# EAGLE design myNucSatellite (EAGLE 7.6.0)
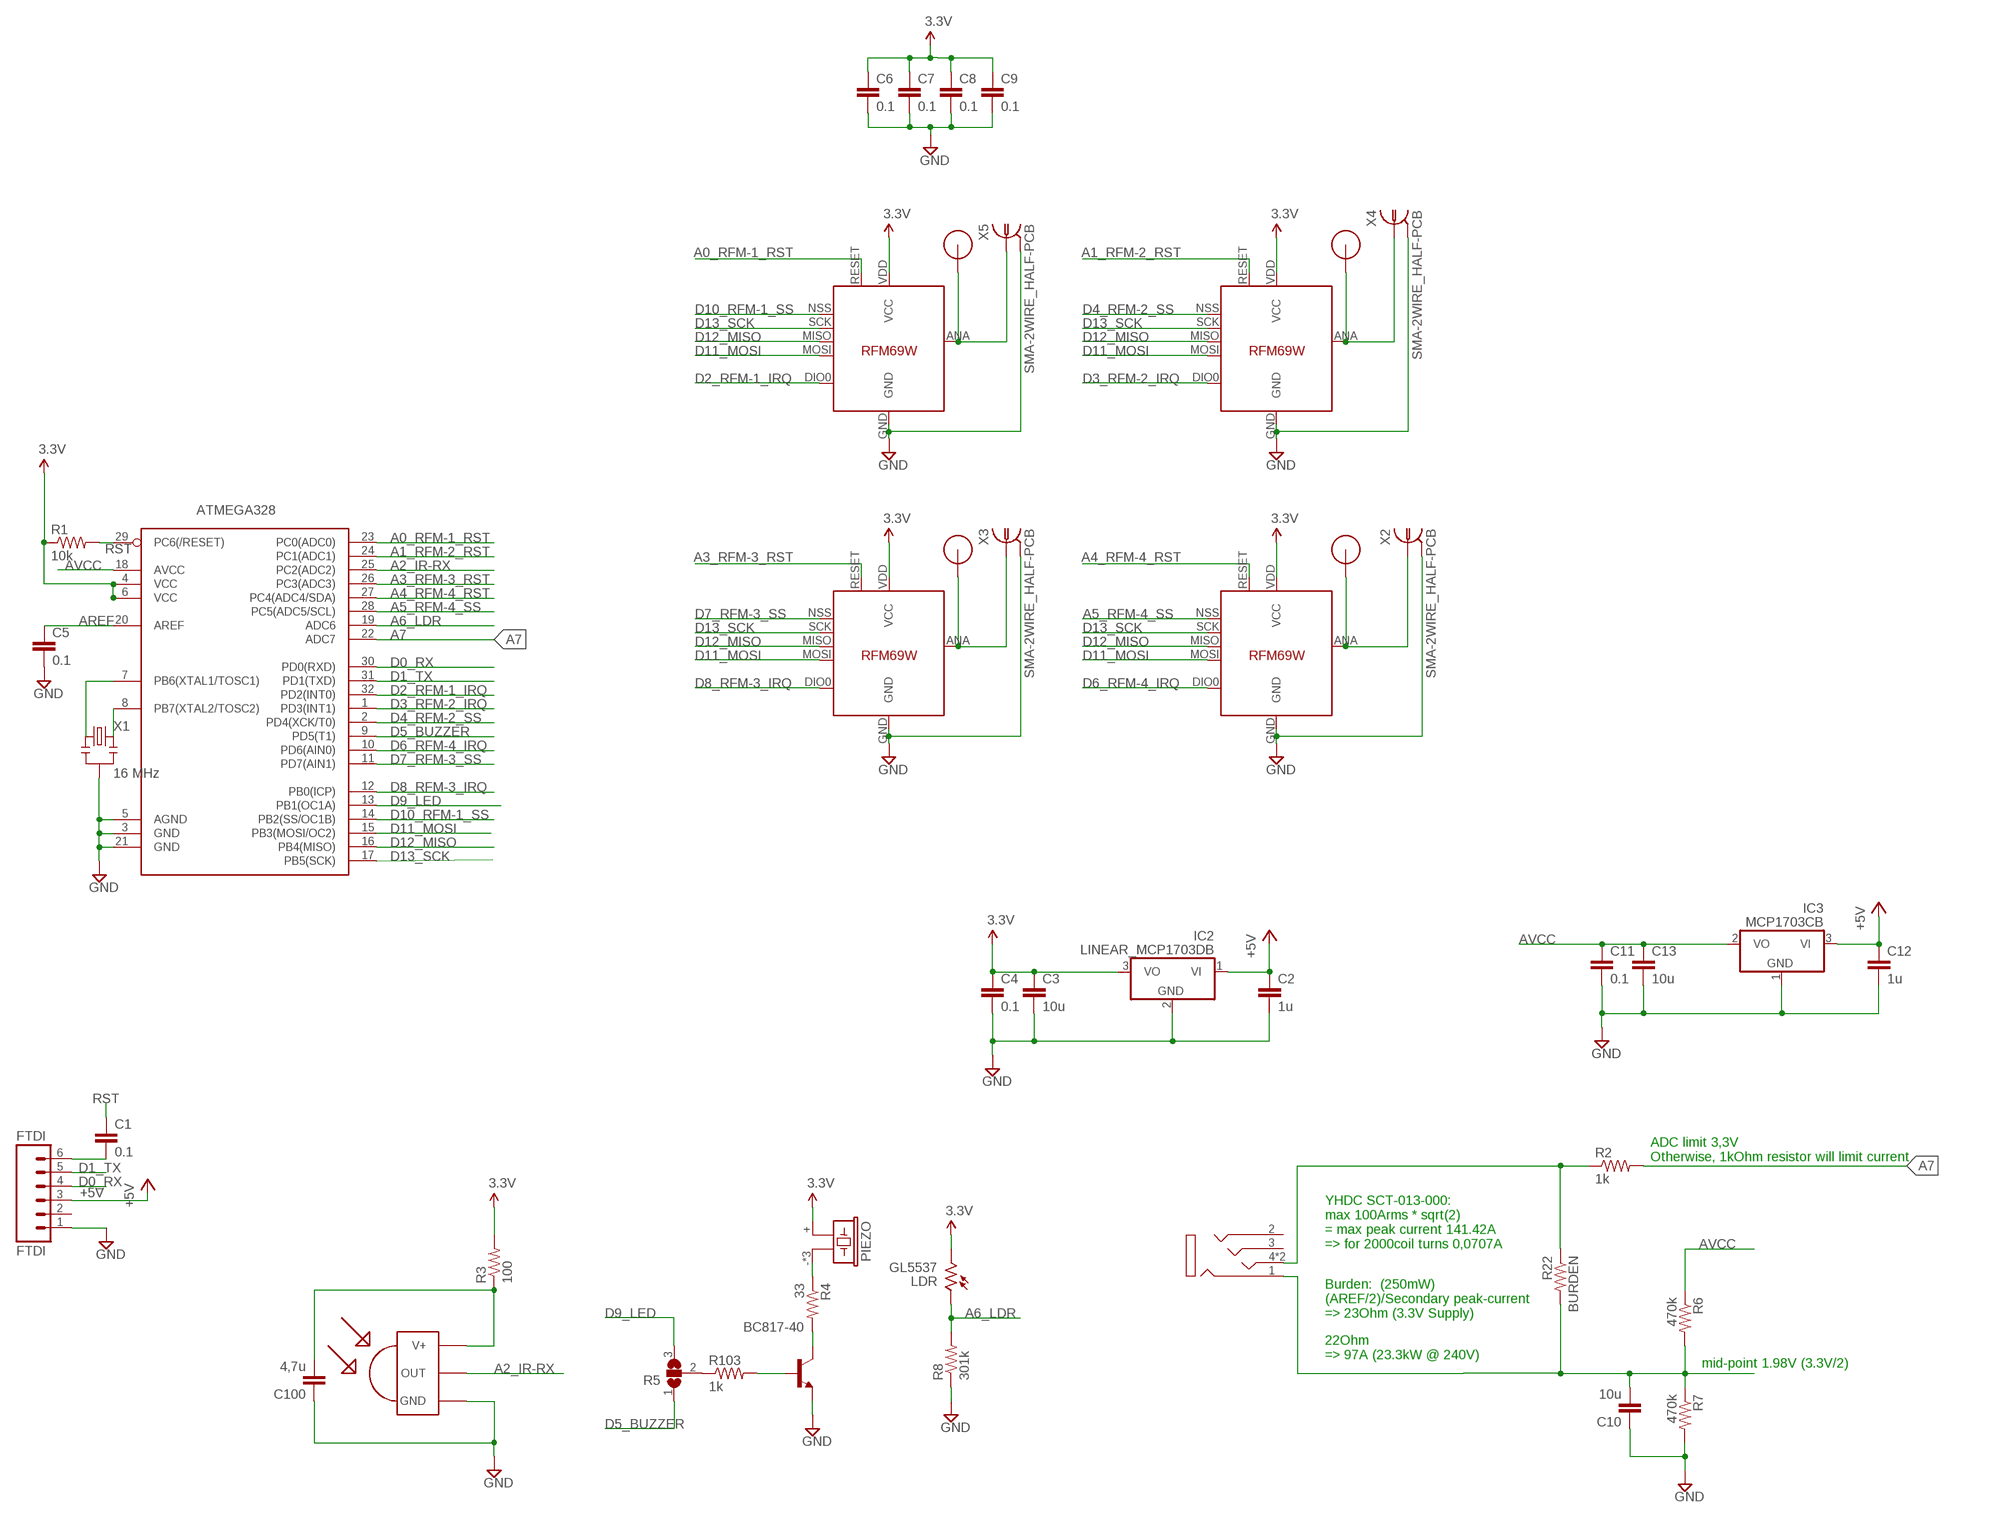
[diagram p0: schematic, sheet 1]

## Parts
ATMEGA328  ATMega-328  ATMEGA168/328TQFP32  [TQFP32-08]
BC817-40  BC817-40-NPN-SOT23-BEC  [SOT23-BEC]
BURDEN  R22  R-US_R0805  [R0805]
C1  0.1  CAP0603-CAP  [0603-CAP]
C2  1u  CAP0603-CAP  [0603-CAP]
C3  10u  CAP0805-CAP  [0805-CAP]
C4  0.1  CAP0603-CAP  [0603-CAP]
C5  0.1  CAP0603-CAP  [0603-CAP]
C6  0.1  CAP0603-CAP  [0603-CAP]
C7  0.1  CAP0603-CAP  [0603-CAP]
C8  0.1  CAP0603-CAP  [0603-CAP]
C9  0.1  CAP0603-CAP  [0603-CAP]
C10  10u  CAP0603-CAP  [0603-CAP]
C11  0.1  CAP0603-CAP  [0603-CAP]
C12  1u  CAP0603-CAP  [0603-CAP]
C13  10u  CAP0805-CAP  [0805-CAP]
C100  4,7u  CAP0603-CAP  [0603-CAP]
CT1  1503_13  [1503-03]
FTDI  FTDI  M06SIP  [1X06]
IC2  LINEAR_MCP1703DB  [LINEAR_SOT223]
IC3  MCP1703CB  [SOT23]
IR-RX  TSOP4836  [TSOP18XX]
LDR  GL5537  M9960_11A  [M9960]
PIEZO  BUZZER-PIEZO_SMD  [BUZZER-PIEZO_SMD]
R1  10k  RESISTOR0603-RES  [0603-RES]
R2  1k  RESISTOR0603-RES  [0603-RES]
R3  100  RESISTOR0603-RES  [0603-RES]
R4  33  RESISTOR0603-RES  [0603-RES]
R5  SELECT0603-SELECT  [0603-SELECT]
R6  470k  RESISTOR0603-RES  [0603-RES]
R7  470k  RESISTOR0603-RES  [0603-RES]
R8  301k  RESISTOR0603-RES  [0603-RES]
R103  1k  RESISTOR0603-RES  [0603-RES]
U$3  RFM12B_ANTENNA  [RFM12B-ANTENNA]
U$4  RFM69_MINIPADS  [RFM69W-MINPADS]
U$6  RFM12B_ANTENNA  [RFM12B-ANTENNA]
U$7  RFM69_MINIPADS  [RFM69W-MINPADS]
U$8  RFM12B_ANTENNA  [RFM12B-ANTENNA]
U$9  RFM69_MINIPADS  [RFM69W-MINPADS]
U$10  RFM12B_ANTENNA  [RFM12B-ANTENNA]
U$11  RFM69_MINIPADS  [RFM69W-MINPADS]
X1  16 MHz  RESONATORSMD  [RESONATOR-SMD]
X2  SMA-2WIRE_HALF-PCB  [SMA-EDGE-HALF]
X3  SMA-2WIRE_HALF-PCB  [SMA-EDGE-HALF]
X4  SMA-2WIRE_HALF-PCB  [SMA-EDGE-HALF]
X5  SMA-2WIRE_HALF-PCB  [SMA-EDGE-HALF]

## Nets
+5V [power]: C2.1 C12.1 FTDI.3 IC2.1(VI) IC3.3(VI)
A0_RFM-1_RST: ATMEGA328.23(PC0(ADC0)) U$4.RESET
A1_RFM-2_RST: ATMEGA328.24(PC1(ADC1)) U$7.RESET
A2_IR-RX: ATMEGA328.25(PC2(ADC2)) IR-RX.OUT
A3_RFM-3_RST: ATMEGA328.26(PC3(ADC3)) U$9.RESET
A4_RFM-4_RST: ATMEGA328.27(PC4(ADC4/SDA)) U$11.RESET
A5_RFM-4_SS: ATMEGA328.28(PC5(ADC5/SCL)) U$11.NSS(SEL)
A6_LDR: ATMEGA328.19(ADC6) LDR.1 R8.2
A7: ATMEGA328.22(ADC7) R2.2
AREF: ATMEGA328.20(AREF) C5.1
AVCC [power]: ATMEGA328.18(AVCC) C11.1 C13.1 IC3.2(VO) R6.1
D0_RX: ATMEGA328.30(PD0(RXD)) FTDI.4
D1_TX: ATMEGA328.31(PD1(TXD)) FTDI.5
D2_RFM-1_IRQ: ATMEGA328.32(PD2(INT0)) U$4.DIO0(DIO0/IRQ)
D3_RFM-2_IRQ: ATMEGA328.1(PD3(INT1)) U$7.DIO0(DIO0/IRQ)
D4_RFM-2_SS: ATMEGA328.2(PD4(XCK/T0)) U$7.NSS(SEL)
D5_BUZZER: ATMEGA328.9(PD5(T1)) R5.1
D6_RFM-4_IRQ: ATMEGA328.10(PD6(AIN0)) U$11.DIO0(DIO0/IRQ)
D7_RFM-3_SS: ATMEGA328.11(PD7(AIN1)) U$9.NSS(SEL)
D8_RFM-3_IRQ: ATMEGA328.12(PB0(ICP)) U$9.DIO0(DIO0/IRQ)
D9_LED: ATMEGA328.13(PB1(OC1A)) R5.3
D10_RFM-1_SS: ATMEGA328.14(PB2(SS/OC1B)) U$4.NSS(SEL)
D11_MOSI: ATMEGA328.15(PB3(MOSI/OC2)) U$4.MOSI U$7.MOSI U$9.MOSI U$11.MOSI
D12_MISO: ATMEGA328.16(PB4(MISO)) U$4.MISO U$7.MISO U$9.MISO U$11.MISO
D13_SCK: ATMEGA328.17(PB5(SCK)) U$4.SCK U$7.SCK U$9.SCK U$11.SCK
GND: ATMEGA328.3(GND) ATMEGA328.5(AGND) ATMEGA328.21(GND) BC817-40.E C2.2 C3.2 C4.2 C5.2 C6.2 C7.2 C8.2 C9.2 C10.1 C11.2 C12.2 C13.2 C100.1 FTDI.1 IC2.2(GND) IC3.1(GND) IR-RX.GND R7.2 R8.1 U$4.GND U$7.GND U$9.GND U$11.GND X1.2 X2.GND@0(GND) X2.GND@1(GND) X3.GND@0(GND) X3.GND@1(GND) X4.GND@0(GND) X4.GND@1(GND) X5.GND@0(GND) X5.GND@1(GND)
N$1: ATMEGA328.7(PB6(XTAL1/TOSC1)) X1.1
N$2: BURDEN.2 C10.2 CT1.1 R6.2 R7.1
N$3: PIEZO.- PIEZO.DUMMY PIEZO.DUMMY1 R4.1
N$4: R5.2 R103.1
N$5 [ANT]: U$3.P$1 U$4.ANA(ANT) X5.SIG(SIGNAL)
N$6: BURDEN.1 CT1.4 CT1.4-2 R2.1
N$7 [ANT]: U$6.P$1 U$7.ANA(ANT) X4.SIG(SIGNAL)
N$8: BC817-40.C R4.2
N$9 [ANT]: U$8.P$1 U$9.ANA(ANT) X3.SIG(SIGNAL)
N$11 [ANT]: U$10.P$1 U$11.ANA(ANT) X2.SIG(SIGNAL)
N$15: BC817-40.B R103.2
N$16: C100.2 IR-RX.VCC(V+) R3.1
N$20: C1.2 FTDI.6
N$21: ATMEGA328.8(PB7(XTAL2/TOSC2)) X1.3
RST: ATMEGA328.29(PC6(/RESET)) C1.1 R1.2
VCC [power]: ATMEGA328.4(VCC) ATMEGA328.6(VCC) C3.1 C4.1 C6.1 C7.1 C8.1 C9.1 IC2.3(VO) LDR.2 PIEZO.+ R1.1 R3.2 U$4.VDD(VCC) U$7.VDD(VCC) U$9.VDD(VCC) U$11.VDD(VCC) ; supply symbol labelled 3.3V
Unconnected: CT1.2 CT1.3 FTDI.2

## Notes on the sheet
- ADC limit 3,3V
  Otherwise, 1kOhm resistor will limit current
- YHDC SCT-013-000: 
  max 100Arms * sqrt(2)
  = max peak current 141.42A
  => for 2000coil turns 0,0707A
- Burden:  (250mW)
  (AREF/2)/Secondary peak-current
  => 23Ohm (3.3V Supply)
- 22Ohm 
  => 97A (23.3kW @ 240V)
- mid-point 1.98V (3.3V/2)

## Library data of the parts
ATMEGA328 = LowPowerLab:ATMEGA168/328: Atmel 32-pin 8-bit micro, 16k flash.; BUERKLIN: 64 S 4010; CONRAD: 155196 - 62
BC817-40 = myLib:*-NPN-: NPN Transistror BF959 corrected 2008.03.06; BUERKLIN: 12S6220
BURDEN = resistor:R-US_: RESISTOR, American symbol; BUERKLIN: 12 E 120
C1 C4-C9 C11 = LowPowerLab:CAP: Capacitor Standard 0603 ceramic capacitor, and 0.1" leaded capacitor.; BUERKLIN: 53 D 1726
C2 C12 = LowPowerLab:CAP: Capacitor Standard 0603 ceramic capacitor, and 0.1" leaded capacitor.; BUERKLIN: 53D1660
C3 C13 = myLib:CAP: Capacitor Standard 0603 ceramic capacitor, and 0.1" leaded capacitor.; BUERKLIN: 53 D 2432
C10 = LowPowerLab:CAP: Capacitor Standard 0603 ceramic capacitor, and 0.1" leaded capacitor.; BUERKLIN: 53 D 2088
C100 = LowPowerLab:CAP: Capacitor Standard 0603 ceramic capacitor, and 0.1" leaded capacitor.; BUERKLIN: 53 D 1659
CT1 = myLib:1503_13; BUERKLIN: 39F1215
FTDI = SparkFun-Connectors:M06: Header 6 Standard 6-pin 0.1" header. Use with straight break away headers (SKU : PRT-00116), right angle break away headers (PRT-00553), swiss pins (PRT-00743), machine pins (PRT-00117), and female headers (PRT-00115). Molex polarized connector foot print use with SKU : PRT-08094 with associated crimp pins and housings. NOTES ON THE VARIANTS LOCK and LOCK_LONGPADS... This footprint was designed to help hold the alignment of a through-hole component (i.e. 6-pin header) while soldering it into place. You may notice that each hole has been shifted either up or down by 0.005 of an inch from it's more standard position (which is a perfectly straight line). This slight alteration caused the pins (the squares in the middle) to touch the edges of the holes. Because they are alternating, it causes a "brace" to hold the component in place. 0.005 has proven to be the perfect amount of "off-center" position when using our standard breakaway headers. Although looks a little odd when you look at the bare footprint, once you have a header in there, the alteration is very hard to notice. Also, if you push a header all the way into place, it is covered up entirely on the bottom side. This idea of altering the position of holes to aid alignment will be further integrated into the Sparkfun Library for other footprints. It can help hold any component with 3 or more connection pins.; BUERKLIN: 59 F 2134
IC2 = myLib:LINEAR_MCP1703: 250 mA, 16V, Low Quiescent Current LDO Regulator Source: http://ww1.microchip.com/downloads/en/DeviceDoc/22049b.pdf; BUERKLIN: 41 S 7654
IC3 = linear:MCP1703: 250 mA, 16V, Low Quiescent Current LDO Regulator Source: http://ww1.microchip.com/downloads/en/DeviceDoc/22049b.pdf; CONRAD: 651422-62
IR-RX = myLib:TSOP4836: IR Receiver and Demodulator; CONRAD: 171107-62; EBAY: TSOP34836
LDR = photo-elements:M9960_11: Photo Sensor Beacon Light, Photometer Applications Source: http://optoelectronics.perkinelmer.com/content/Datasheets/DTS_M9960.pdf; EBAY: GL5537
PIEZO = myLib:BUZZER-PIEZO_SMD: Piezoelectric Acoustic Transducer; BERKLIN_2: 36 M 346; BUERKLIN: 36 M 370; BUERKLIN_1: 36 M 368
R1 = LowPowerLab:RESISTOR: Resistor Basic schematic elements and footprints for 0603, 1206, and PTH resistors.; BUERKLIN: 26 E 816
R2 R103 = LowPowerLab:RESISTOR: Resistor Basic schematic elements and footprints for 0603, 1206, and PTH resistors.; BUERKLIN: 26 E 792
R3 = LowPowerLab:RESISTOR: Resistor Basic schematic elements and footprints for 0603, 1206, and PTH resistors.; BUERKLIN: 26 E 768
R4 = LowPowerLab:RESISTOR: Resistor Basic schematic elements and footprints for 0603, 1206, and PTH resistors.; BUERKLIN: 26 E 756
R5 = myLib:SELECT: Resistor Basic schematic elements and footprints for 0603, 1206, and PTH resistors.
R6 R7 = LowPowerLab:RESISTOR: Resistor Basic schematic elements and footprints for 0603, 1206, and PTH resistors.; BUERKLIN: 26 E 856
R8 = LowPowerLab:RESISTOR: Resistor Basic schematic elements and footprints for 0603, 1206, and PTH resistors.; BUERKLIN: 26 E 7197
U$3 U$6 U$8 U$10 = LowPowerLab:RFM12B_ANTENNA
U$4 U$7 U$9 U$11 = myLib:RFM69_MINIPADS
X1 = SparkFun:RESONATOR: Resonator Small SMD resonator. This is the itty bitty 10/20MHz resonators with built in caps. CSTCE10M0G55 and CSTCE20M0V53. Footprint has been reviewed closely but hasn't been tested yet.
X2-X5 = myLib:SMA-2WIRE_HALF-PCB: SMA 50 Ohm Straight Jack Receptacle - PCB Mountung www.telegaertner.de Source: Buerklin Artikelnummer: J01151A0931

## Net classes
0 default: width 0.305 mm, clearance 0.254 mm
1 power: width 0.381 mm, clearance 0.254 mm
2 ANT: width 1.016 mm, clearance 0.254 mm

## Board
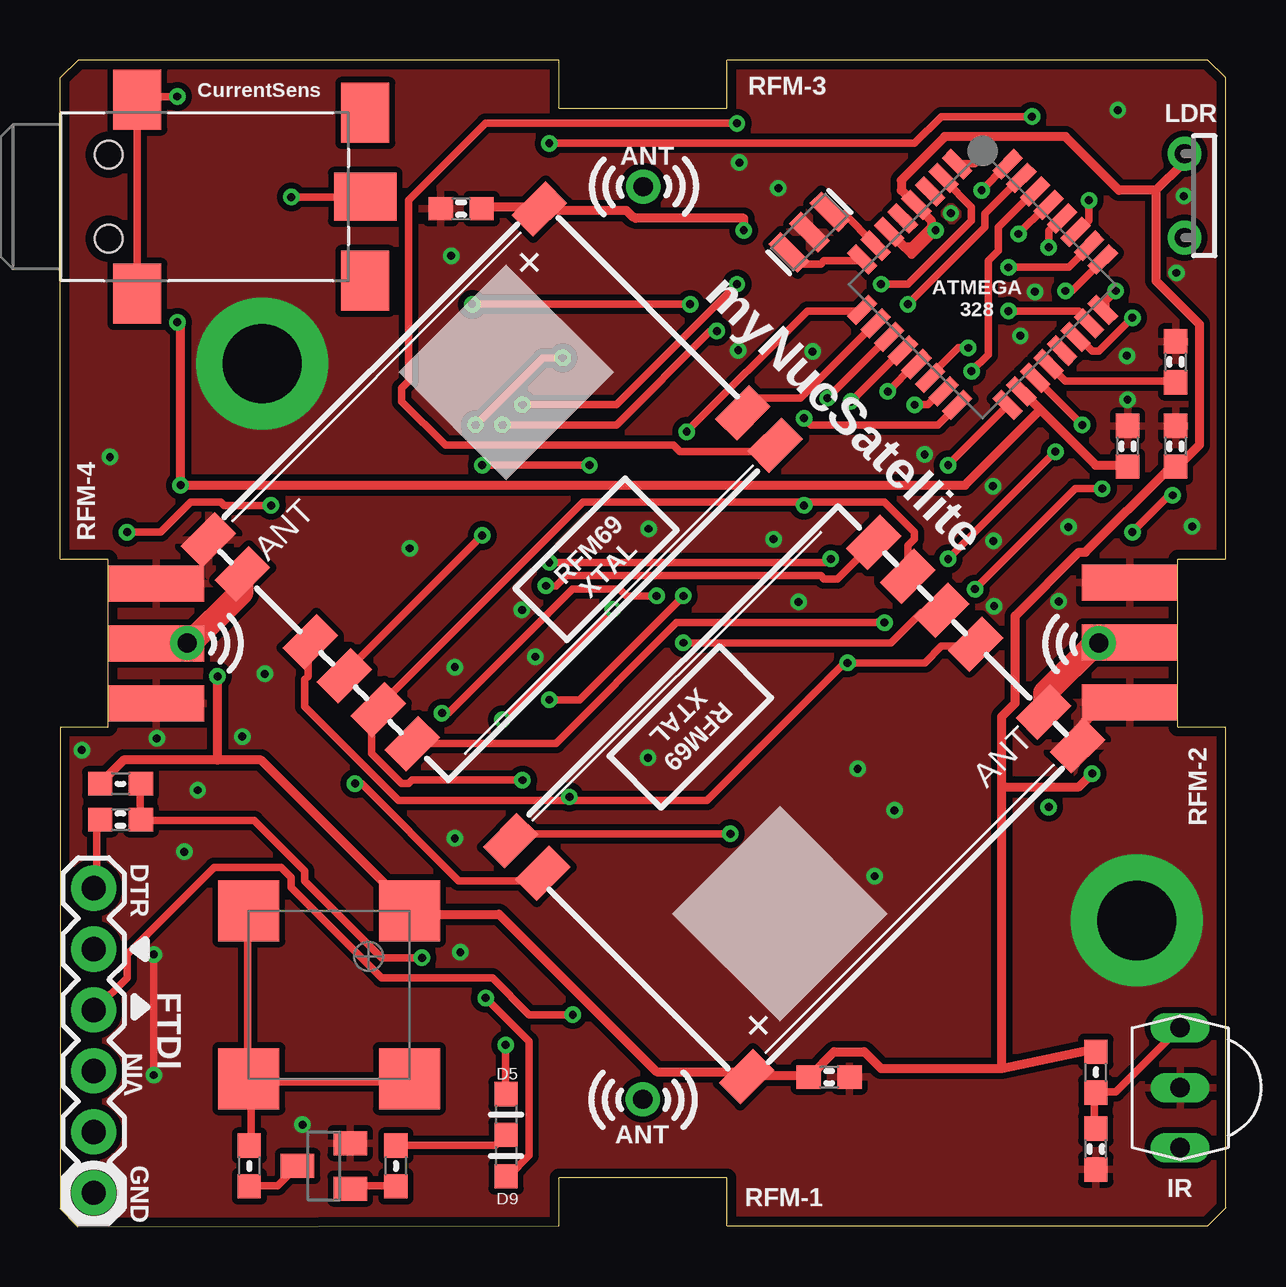
[diagram p1: board, top side]
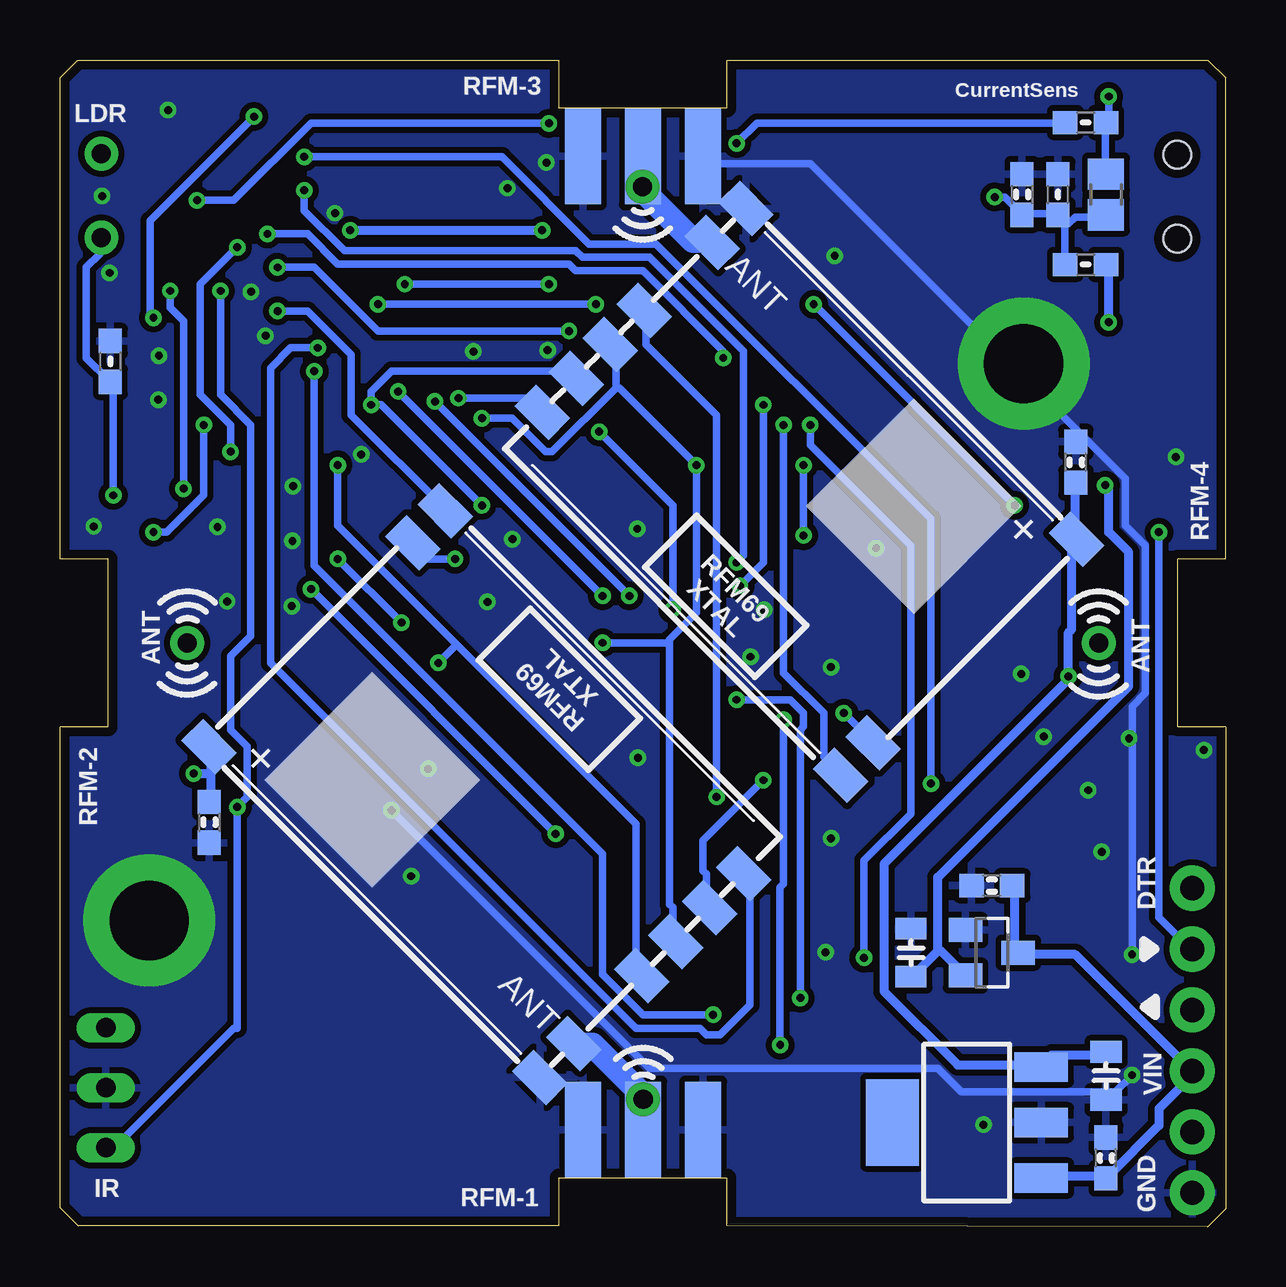
[diagram p2: board, bottom side, seen from below]

Size 48.6 x 48.63 mm. Coordinates in mm from the lower left corner, seen from the top.
Outline: 20.8,48.63 0.76,48.63 0,47.88 0,27.83 2,27.83 2,20.83 0,20.83 0,0.75 0.75,0 20.8,0.03 20.8,2.03 27.8,2.03 27.8,0.03 47.84,0.03 48.6,0.77 48.6,20.83 46.6,20.83 46.6,27.83 48.6,27.83 48.6,47.88 47.85,48.63 27.8,48.63 27.8,46.63 20.8,46.63 20.8,48.63
Copper layers (1*16): Top 0.0356mm / dielectric 1.5011mm / Bottom 0.0356mm
Design rules "oshpark-2layer *": minimum track width 6mil, minimum drill 13mil, track to track 6mil, track to pad 6mil, pad to pad 6mil, via to via 6mil, smd to smd 6mil, copper to edge 15mil, drill to drill 6mil, minimum pad ring 7mil, minimum via ring 7mil, stop-mask expansion 2.5mil, vias tented up to drill 100mil, thermal gap 10mil

### Footprints (pad centres in the part's own frame; a part is rotated, then mirrored left to right if it is on the bottom)
TQFP32-08 = smd 1.27 x 0.533: 1 -4.293,2.8; 2 -4.293,2; 3 -4.293,1.2; 4 -4.293,0.4; 5 -4.293,-0.4; 6 -4.293,-1.2; 7 -4.293,-2; 8 -4.293,-2.8; 17 4.293,-2.8; 18 4.293,-2; 19 4.293,-1.2; 20 4.293,-0.4; 21 4.293,0.4; 22 4.293,1.2; 23 4.293,2; 24 4.293,2.8 | smd 0.533 x 1.27: 9 -2.8,-4.293; 10 -2,-4.293; 11 -1.2,-4.293; 12 -0.4,-4.293; 13 0.4,-4.293; 14 1.2,-4.293; 15 2,-4.293; 16 2.8,-4.293; 25 2.8,4.293; 26 2,4.293; 27 1.2,4.293; 28 0.4,4.293; 29 -0.4,4.293; 30 -1.2,4.293; 31 -2,4.293; 32 -2.8,4.293
SOT23-BEC = smd 1 x 1.4: B -0.95,-1.1; C 0,1.1; E 0.95,-1.1
R0805 = smd 1.3 x 1.5: 1 -0.85,0; 2 0.85,0
0603-CAP = smd 1.016 x 0.965: 1 -0.85,0; 2 0.85,0
0805-CAP = smd 0.902 x 1.3: 1 -1,0; 2 1,0
1503-03 = smd 2.6 x 2: 1 12.7,0 | smd 2 x 2.5: 2 12.7,-3.5; 3 12.7,3.5; 4 3.2,4.05; 4-2 3.2,-4.05 | hole 1.15: 2,-1.75; 2,1.75
1X06 = drill 1.016 pad 1.88: 1 0,0; 2 2.54,0; 3 5.08,0; 4 7.62,0; 5 10.16,0; 6 12.7,0
LINEAR_SOT223 = smd 1.219 x 2.235: 1 -2.311,-3.099; 2 0,-3.099; 3 2.311,-3.099 | smd 3.6 x 2.2: 4 0,3.099
SOT23 = smd 1 x 1.4: 1 -0.95,-1.1; 2 0.95,-1.1; 3 0,1.1
TSOP18XX = drill 0.813 long: GND -0.001,-0.027; OUT -2.501,-0.027; VCC 2.499,-0.027
M9960 = drill 0.8 pad 1.4: 1 -1.75,0; 2 1.75,0
BUZZER-PIEZO_SMD = smd 2.54 x 2.54: + 0,6.7; - 7,6.7; DUMMY 0,0; DUMMY1 7,0
0603-RES = smd 1.016 x 0.965: 1 -0.85,0; 2 0.85,0
0603-SELECT = smd 1.016 x 0.965: 1 -0.85,0; 2 0.85,0; 3 2.577,0
RFM12B-ANTENNA = drill 0.8 pad 1.422: P$1 0,0
RFM69W-MINPADS = smd 2 x 1.27: ANA 8,-5; DIO0 -11.5,5; GND 8,-7; MISO 8,1; MOSI 8,3; NSS 8,5; RESET -11.5,6.909; SCK 8,-1; VDD -11.5,-7
RESONATOR-SMD = smd 0.7 x 1.7: 1 -1.2,0; 2 0,0; 3 1.2,0
SMA-EDGE-HALF = smd 1.5 x 4: GND@0 0,0; GND@1 5,0; SIG 2.5,0

### Placement (x,y rotation side)
ATMEGA328  38.45,39.26 315 top
BC817-40  11,2.53 90 top
BURDEN  5,43.02 270 bottom
C1  2.53,16.96 180 top
C2  5,2.86 90 bottom
C3  5,6.28 270 bottom
C4  46.5,32.53 90 top
C5  46.5,36.04 90 top
C6  32.06,6.23 0 top
C7  42.37,16.85 270 bottom
C8  6.26,31.86 90 bottom
C9  16.72,42.43 180 top
C10  8.5,43.02 270 bottom
C11  44.5,32.53 90 top
C12  9.76,14.21 180 bottom
C13  13.13,11.41 90 bottom
C100  43.18,3.23 90 top
CT1  0.03,42.93 0 top
FTDI  1.4,1.4 90 top
IC2  10.8,4.34 90 bottom
IC3  9.76,11.41 270 bottom
IR-RX  46.66,5.79 90 top
LDR  46.88,42.97 90 top
PIEZO  7.87,13.16 270 top
R1  2.53,18.46 0 top
R2  5.85,46.02 180 bottom
R3  43.18,6.43 90 top
R4  7.89,2.53 270 top
R5  18.59,4.67 270 top
R6  5.85,40.1 180 bottom
R7  7,43.02 90 bottom
R8  46.5,36.06 270 bottom
R103  14,2.53 270 top
U$3  24.29,5.3 90 top
U$4  29.3,16.83 315 bottom
U$6  43.3,24.33 0 top
U$7  31.8,19.33 45 top
U$8  24.31,43.35 90 top
U$9  19.3,31.83 135 bottom
U$10  5.3,24.33 0 top
U$11  16.8,29.33 225 top
X1  31.24,41.45 225 top
X2  4.01,21.81 90 top
X3  21.8,44.61 180 bottom
X4  44.6,21.84 90 top
X5  26.79,4.03 0 bottom

### Tracks (layer width: path | path; a pad name or v marks a point on that pad's centre or on a via)
+5V
  Bottom 0.381: IC2.1 7.68,2.12 5.03,2.12 C2.1 4.89,2.12 2.79,4.22 2.79,4.91 1.4,6.31 FTDI.3 1.54,6.59 6.29,11.34 8.52,11.34 IC3.3 8.66,11.48 8.8,11.62 8.8,14.14 C12.1
A0_RFM-1_RST  (via drill 0.33)
  Top 0.305: v39.53,38.16 42.47,38.16 42.89,37.74 ATMEGA328.23
  Bottom 0.305: v39.53,38.16 38.28,38.16 36.46,36.35 36.46,33.83 32.55,29.92 U$4.RESET
A1_RFM-2_RST  (via drill 0.33)
  Top 0.305: v44.01,39 43.59,38.58 43.59,38.3 ATMEGA328.24 | v43.45,30.76 42.33,30.76 v38.14,26.57 | v27.94,16.37 19.14,16.37 18.86,16.09 U$7.RESET
  Bottom 0.305: v44.01,39 44.01,38.3 43.45,37.74 v43.45,30.76 | v27.94,16.37 v38.14,26.57
A2_IR-RX  (via drill 0.33)
  Top 0.305: v41.91,39 42.19,39 43.45,40.26 ATMEGA328.25
  Bottom 0.305: v41.91,39 41.91,34.67 40.65,33.41 40.65,24.61 41.49,23.77 41.49,20.7 40.79,20 40.79,17.91 v41.21,17.49 41.21,8.27 41.35,8.27 46.24,3.38 46.66,3.38 IR-RX.OUT
A3_RFM-3_RST  (via drill 0.33)
  Top 0.305: v39.53,39.98 42.05,39.98 42.89,40.82 ATMEGA328.26 | v27.38,37.33 27.1,37.33 23.19,33.41 v18.44,33.41
  Bottom 0.305: v39.53,39.98 38,39.98 35.34,37.33 v27.38,37.33 | v18.44,33.41 18.44,23.08 16.76,21.4 16.76,19.58 16.07,18.89 U$9.RESET
A4_RFM-4_RST  (via drill 0.33)
  Top 0.305: v42.89,42.77 42.89,41.94 42.47,41.52 ATMEGA328.27 | v28.22,45.99 17.74,45.99 14.53,42.77 14.53,35.23 14.25,34.95 14.25,34.39 16.07,32.58 25.57,32.58 25.84,32.3 29.62,32.3 29.76,32.44 U$11.RESET
  Bottom 0.305: v42.89,42.77 41.35,42.77 38.14,45.99 v28.22,45.99
A5_RFM-4_SS  (via drill 0.33)
  Top 0.305: v41.21,40.82 41.21,41.52 41.63,41.94 ATMEGA328.28 | v37.02,27.83 v41.49,32.3 | v34.37,25.17 25.7,25.17 20.68,20.14 14.81,20.14 U$11.NSS
  Bottom 0.305: v41.21,40.82 42.75,39.28 42.75,34.67 41.49,33.41 v41.49,32.3 | v34.37,25.17 v37.02,27.83
A6_LDR  (via drill 0.33)
  Top 0.305: v42.61,33.41 40.65,35.37 ATMEGA328.19 | v44.7,28.94 46.24,30.48 v46.38,30.48
  Bottom 0.305: v42.61,33.41 42.61,30.48 44.15,28.94 v44.7,28.94 | v46.38,30.48 46.38,35.09 R8.2 46.52,35.23 47.5,36.21 47.5,39.98 46.94,40.54 46.94,40.82 LDR.1
A7  (via drill 0.33)
  Top 0.305: v20.4,45.15 35.62,45.15 36.74,46.27 v40.51,46.27 | v44.7,37.88 43.31,36.49 43.03,36.49 42.47,37.05 ATMEGA328.22
  Bottom 0.305: v20.4,45.15 19.56,45.99 6.71,45.99 R2.2 | v40.51,46.27 44.84,41.94 44.84,38.02 v44.7,37.88
AREF
  Top 0.305: C5.1 46.38,35.23 41.91,35.23 41.21,35.93 ATMEGA328.20
AVCC  (via drill 0.33)
  Top 0.381: 40.86,34.04 40.09,34.81 ATMEGA328.18 | 40.86,34.04 43.17,31.74 44.42,31.74 C11.1 | 40.86,34.04 37.72,30.9 v5.03,30.9 5.03,37.47 v4.89,37.69 4.89,37.54
  Bottom 0.381: 12.01,11.48 12.01,14.55 4.05,22.52 4.05,28.11 4.89,28.94 4.89,30.9 v5.03,30.9 | 12.01,11.48 12.99,10.5 C13.1 | 4.89,39.98 R6.1 4.89,39.84 v4.89,37.69 | IC3.2 10.9,10.5 11.87,11.48 12.01,11.48
D0_RX  (via drill 0.33)
  Top 0.305: v38,35.65 38.7,36.35 38.7,40.26 39.12,40.68 39.12,41.66 40.51,43.05 ATMEGA328.30 | v21.37,8.83 19.56,8.83 18.02,10.36 13.41,10.36 9.64,14.14 9.64,14.55 9.22,14.97 6.43,14.97 2.79,11.34 2.79,10.36 1.54,9.11 FTDI.4
  Bottom 0.305: v38,35.65 38,27.55 25.98,15.53 25.98,10.5 24.31,8.83 v21.37,8.83
D1_TX  (via drill 0.33)
  Top 0.305: v35.34,38.44 38.56,41.66 38.56,42.21 39.95,43.61 ATMEGA328.31 | v17.18,38.44 v26.26,38.44 | v8.8,30.06 6.84,30.06 6.71,30.2 5.45,30.2 4.19,28.94 v2.79,28.94
  Bottom 0.305: v26.26,38.44 v35.34,38.44 | v8.8,30.06 v17.18,38.44 | v2.79,28.94 2.79,12.88 1.54,11.62 FTDI.5
D2_RFM-1_IRQ  (via drill 0.33)
  Top 0.305: v38.42,43.19 39.4,44.17 ATMEGA328.32 | v20.4,27.69 31.99,27.69 v32.13,27.83
  Bottom 0.305: v38.42,43.19 38.42,42.35 36.74,40.68 27.1,40.68 26.82,40.4 24.03,40.4 20.12,36.49 20.12,27.97 v20.4,27.69 | v32.13,27.83 33.25,27.83 33.81,28.38 U$4.DIO0
D3_RFM-2_IRQ  (via drill 0.33)
  Top 0.305: v38.42,44.59 38.14,44.31 37.44,44.31 ATMEGA328.1 | v12.29,18.47 12.57,18.47 16.62,14.41 19.84,14.41 20.12,14.69 U$7.DIO0
  Bottom 0.305: v38.42,44.59 30.18,44.59 26.54,40.96 23.75,40.96 12.29,29.5 v12.29,18.47
D4_RFM-2_SS  (via drill 0.33)
  Top 0.305: v34.23,39.28 35.34,39.28 38,41.94 38,42.49 36.88,43.61 ATMEGA328.2 | v28.22,39.28 23.19,34.25 v19.28,34.25 | v20.26,26.71 20.68,26.71 21.09,27.13 31.71,27.13 31.85,26.99 32.41,26.99 33.81,28.38 U$7.NSS
  Bottom 0.305: v28.22,39.28 v34.23,39.28 | v19.28,34.25 19.28,27.69 v20.26,26.71
D5_BUZZER  (via drill 0.33)
  Top 0.305: v18.58,7.57 18.58,5.61 R5.1 | v23.05,25.73 v18.44,21.12 | v26.12,33.13 31.15,38.16 33.39,38.16 ATMEGA328.9
  Bottom 0.305: v18.58,7.57 18.58,14.14 18.44,14.27 v18.44,21.12 | v23.05,25.73 23.05,30.06 v26.12,33.13
D6_RFM-4_IRQ
  Top 0.305: ATMEGA328.10 33.95,37.6 30.87,34.53 29.06,34.53 28.5,33.97 U$11.DIO0
D7_RFM-3_SS  (via drill 0.33)
  Top 0.305: v31.99,34.53 34.51,37.05 ATMEGA328.11
  Bottom 0.305: v31.99,34.53 29.06,34.53 28.5,33.97 U$9.NSS
D8_RFM-3_IRQ  (via drill 0.33)
  Top 0.305: v32.97,34.39 35.06,36.49 ATMEGA328.12 | v24.87,26.29 23.61,26.29 23.33,26.57 21.37,26.57 16.2,21.4 v15.93,21.4
  Bottom 0.305: v24.87,26.29 v32.97,34.39 | v15.93,21.4 14.81,20.28 U$9.DIO0
D9_LED  (via drill 0.33)
  Top 0.305: v17.74,9.53 19.56,7.71 19.56,2.96 18.72,2.12 R5.3 | v20.4,21.96 21.65,21.96 v25.98,26.29 | v34.51,34.81 35.62,35.93 ATMEGA328.13
  Bottom 0.305: v17.74,9.53 17.74,20.7 17.6,20.84 17.6,21.4 18.16,21.96 v20.4,21.96 | v34.51,34.81 v25.98,26.29
D10_RFM-1_SS  (via drill 0.33)
  Top 0.305: v37.86,36.63 37.44,36.63 36.32,35.51 ATMEGA328.14
  Bottom 0.305: v37.86,36.63 38.98,36.63 39.81,35.79 39.81,23.5 24.59,8.27 21.93,8.27 21.65,7.99 21.09,7.99 19.84,9.25 19.84,14.55 19.98,14.69 U$4.NSS
D11_MOSI  (via drill 0.33)
  Top 0.305: v35.62,34.25 36.18,34.25 36.74,34.81 ATMEGA328.15 | v19.28,18.61 14.67,18.61 14.53,18.47 14.25,18.47 12.99,19.72 12.99,21.4 13.13,21.54 U$11.MOSI 13.27,21.68 21.79,30.2 31.01,30.2 | 31.01,30.2 34.37,30.2 35.62,28.94 35.62,28.66 35.34,28.38 35.34,27.13 U$7.MOSI | v31.01,30.06 31.01,30.2
  Bottom 0.305: U$9.MOSI 27.1,35.37 27.38,35.65 34.78,35.65 35.62,34.81 v35.62,34.25 35.2,34.25 v31.01,30.06 | v19.28,18.61 21.79,16.09 21.79,14.83 21.65,14.69 21.65,13.3 U$4.MOSI
D12_MISO  (via drill 0.33)
  Top 0.305: v31.01,33.69 31.29,33.41 36.6,33.41 37.3,34.11 ATMEGA328.16 | v17.6,28.8 11.87,23.08 U$11.MISO | v22.07,31.74 v17.6,31.74 | v25.98,24.33 34.65,24.33 35.9,25.59 36.74,25.59 U$7.MISO
  Bottom 0.305: v31.01,33.69 29.76,33.69 28.36,32.3 28.08,32.3 25.43,34.95 | 25.43,34.95 25.43,36.63 25.57,36.77 U$9.MISO | v17.6,31.74 v17.6,28.8 | 25.43,34.95 25.29,34.95 v22.07,31.74 22.07,25.59 23.19,24.47 23.19,24.33 | 23.19,24.33 23.19,13.44 23.05,13.3 23.05,11.9 U$4.MISO | 23.19,24.33 v25.98,24.33
D13_SCK  (via drill 0.33)
  Top 0.305: v37.02,31.74 39.4,34.11 ATMEGA328.17 | U$7.SCK 38.14,24.19 36.74,24.19 36.04,23.5 v32.83,23.5 32.69,23.5 26.96,17.77 21.23,17.77 | 21.23,17.77 14.11,17.77 10.2,21.68 10.2,22.8 10.34,22.94 10.34,24.33 U$11.SCK | v21.23,17.91 21.23,17.77
  Bottom 0.305: v37.02,31.74 37.02,29.22 32.06,24.26 | 32.06,24.26 24.59,16.79 24.59,10.64 24.45,10.5 U$4.SCK | 32.06,24.26 v32.83,23.5 | v21.23,17.91 21.23,33.83 24.17,36.77 24.17,38.16 U$9.SCK
GND  (via drill 0.33, 3.3 pad 5.5)
  Top 0.305: v3.91,11.34 v3.91,6.31 | 44.56,22.1 X4.GND@0
  Top 0.406: X4.GND@0 44.21,21.84 arc90 U$7.GND
  Bottom 0.305: v34.78,17.35 24.03,6.59 12.01,6.59 11.04,5.61 4.61,5.61 v3.91,6.31 | v3.91,11.34 3.91,21.68 3.35,22.24 3.35,28.38 4.19,29.22 4.19,31.18 17.32,44.31 21.51,44.31 21.79,44.59 X3.GND@0
  other vias: 44.88,12.75 8.43,35.97 7.59,20.42 4.04,20.35 5.74,18.19 5.18,15.62 8.53,23.04 16.46,16.18 33.96,14.6 33.25,19.08 38.94,25.86 38.91,28.58 38.89,30.86 42.04,29.16 41.63,26.06 47.19,29.18 46.53,39.75 44.48,36.3 44.5,34.47 40.03,37.13 40.64,38.96 31.37,36.47 28.27,36.53 16.31,40.46 37.13,42.24 36.04,32.18 24.51,19.53 30.78,26.04 29.74,28.65 24.54,29.08 14.58,28.27 10.11,4.24 16.69,11.43 44.09,46.53 46.85,42.95 16.46,23.32 29.95,43.28 28.32,44.35 2.08,32.08 19.81,23.75 19.25,25.7 0.91,19.86
  pour Bottom: -1.7,50.52 50.42,50.52 50.42,-1.83 -1.7,-1.83
  pour Top: -2.18,50.85 51.28,50.9 51.28,-2.79 -2.57,-2.79 -2.64,50.85
N$1
  Top 0.305: ATMEGA328.7 33.95,40.96 32.69,42.21 32.13,42.21 X1.1
N$2  (via drill 0.33)
  Top 0.305: v9.64,42.91 12.71,42.91 CT1.1
  Bottom 0.305: R6.2 6.71,40.12 6.71,41.8 6.99,42.08 R7.1 | R7.1 7.12,42.21 8.38,42.21 C10.2 8.52,42.21 9.22,42.91 v9.64,42.91 | BURDEN.2 5.03,42.08 6.29,42.08 6.57,41.8 R7.1
N$3
  Top 0.305: R4.1 7.96,3.38 7.96,6.03 PIEZO.DUMMY1 | PIEZO.- 14.53,6.03 8.1,6.03 PIEZO.DUMMY1 | PIEZO.DUMMY 7.82,13.16 7.82,6.31 PIEZO.DUMMY1
N$4
  Top 0.305: R103.1 14.11,3.38 18.16,3.38 18.58,3.8 R5.2
N$5
  Bottom 1.016: U$4.ANA 27.1,7.57 26.4,7.57 24.17,5.33 X5.SIG 24.31,5.33 U$3.P$1
N$6  (via drill 0.33)
  Top 0.305: v4.89,47.1 3.35,47.1 CT1.4 3.21,46.83 3.21,39 CT1.4-2
  Bottom 0.305: BURDEN.1 5.03,43.89 5.03,45.99 R2.1 4.89,46.13 v4.89,47.1
N$7
  Top 1.016: U$7.ANA 41.07,21.54 41.07,22.24 43.17,24.33 X4.SIG U$6.P$1
N$8
  Top 0.305: R4.2 7.96,1.7 9.08,1.7 9.78,2.4 BC817-40.C
N$9
  Bottom 1.016: U$9.ANA 21.51,41.1 22.21,41.1 24.45,43.33 X3.SIG 24.31,43.33 U$8.P$1
N$11
  Top 1.016: U$11.ANA 7.54,27.13 7.54,26.43 5.31,24.19 X2.SIG U$10.P$1
N$15
  Top 0.305: R103.2 13.97,1.7 12.15,1.7 BC817-40.B
N$16
  Top 0.305: C100.2 43.12,4.19 43.12,5.45 R3.1 | 43.26,5.59 R3.1 | R3.1 43.31,5.61 44.01,5.61 46.66,8.27 IR-RX.VCC
N$20
  Top 0.305: C1.2 1.54,16.93 1.54,14.14 FTDI.6
N$21
  Top 0.305: ATMEGA328.8 33.39,40.26 31.85,40.26 31.71,40.12 30.87,40.12 30.45,40.54 X1.3
RST  (via drill 0.33)
  Top 0.305: R1.2 3.35,18.33 3.35,17.07 C1.1 3.49,16.93 8.1,16.93 10.2,14.83 10.2,14.41 13.41,11.2 v15.09,11.2 | v39.95,41.38 41.07,42.49 ATMEGA328.29 | v20.95,36.21 20.12,36.21 v17.32,33.41
  Bottom 0.305: v39.95,41.38 38.28,41.38 37.02,40.12 27.38,40.12 27.1,39.84 24.31,39.84 20.95,36.49 v20.95,36.21 | v17.32,33.41 17.32,32.58 13.13,28.38 13.13,17.21 15.09,15.25 v15.09,11.2
VCC  (via drill 0.33)
  Top 0.381: C9.1 17.6,42.49 19.98,42.49 U$11.VDD 20.12,42.35 23.61,42.35 23.89,42.08 24,42.03 28.5,42.03 v28.5,41.53 | 46.38,31.74 C4.1 | 39.26,6.59 34.23,6.59 33.53,7.29 32.27,7.29 31.29,6.31 C6.1 31.15,6.31 28.64,6.31 U$7.VDD 28.5,6.45 24.87,6.45 18.3,13.02 14.67,13.02 PIEZO.+ 14.53,13.3 8.38,19.44 6.57,19.44 | 39.26,6.59 43.12,7.4 R3.2 | 6.57,19.44 2.65,19.44 R1.1 | 6.57,19.44 v6.57,22.94 | 39.26,6.59 39.26,18.33 | 39.26,18.33 39.26,21.26 39.81,21.82 39.81,25.45 42.47,28.11 42.75,28.11 46.24,31.6 C4.1 | v36.5,41.53 35.5,40.53 35,41.03 ATMEGA328.6 34.65,41.38 35.2,40.82 35.48,40.82 36.32,41.66 36.32,41.94 35.76,42.49 ATMEGA328.4 35.62,42.63 35.06,43.19 35.06,43.61 36.88,45.43 41.91,45.43 44.15,43.19 45.68,43.19 | v43.03,18.89 42.47,18.33 39.26,18.33 | 45.68,43.19 45.68,39.42 47.5,37.6 47.5,32.58 46.66,31.74 C4.1 | 45.68,43.19 46.8,44.31 LDR.2
  Bottom 0.381: 42.33,18.89 42.33,20 U$4.VDD | 42.33,18.89 42.33,17.77 C7.1 | C3.1 5.03,7.15 7.26,7.15 7.68,6.73 IC2.3 7.82,6.73 11.18,6.73 14.25,9.8 14.25,15.11 6.57,22.8 v6.57,22.94 6.57,24.75 6.43,24.89 6.43,28.52 U$9.VDD 6.29,28.66 6.29,30.9 C8.1 | v36.5,41.53 v28.5,41.53 | v43.03,18.89 42.33,18.89

### Text on the board
tPlace: myNucSatellite | RFM69 / XTAL | RFM69 / XTAL
bPlace: RFM69 / XTAL | RFM69 / XTAL
tDocu: REG
_tsilk: RFM-3 | CurrentSens | LDR | ANT | ATMEGA / 328 | RFM-4 | RFM-2 | DTR | FTDI | D5 | VIN | ANT | GND | D9 | RFM-1 | IR
_bsilk: RFM-3 | CurrentSens | LDR | RFM-4 | ANT | ANT | RFM-2 | DTR | VIN | GND | RFM-1 | IR